# Altium schematic sheet ACEstat_carrier.SchDoc: ACEstat Carrier Board
size 419 x 296 mm; Date: 2/1/2022; Author: Eric Brown; DrawnBy: Eric Brown; Engineer: Eric Brown; Revision: 1.0.0; SheetNumber: 1; SheetTotal: 1; ProjectTitle: Mobile Environmental Contaminant Sensors Program; BranchName: Sensors Integration branch
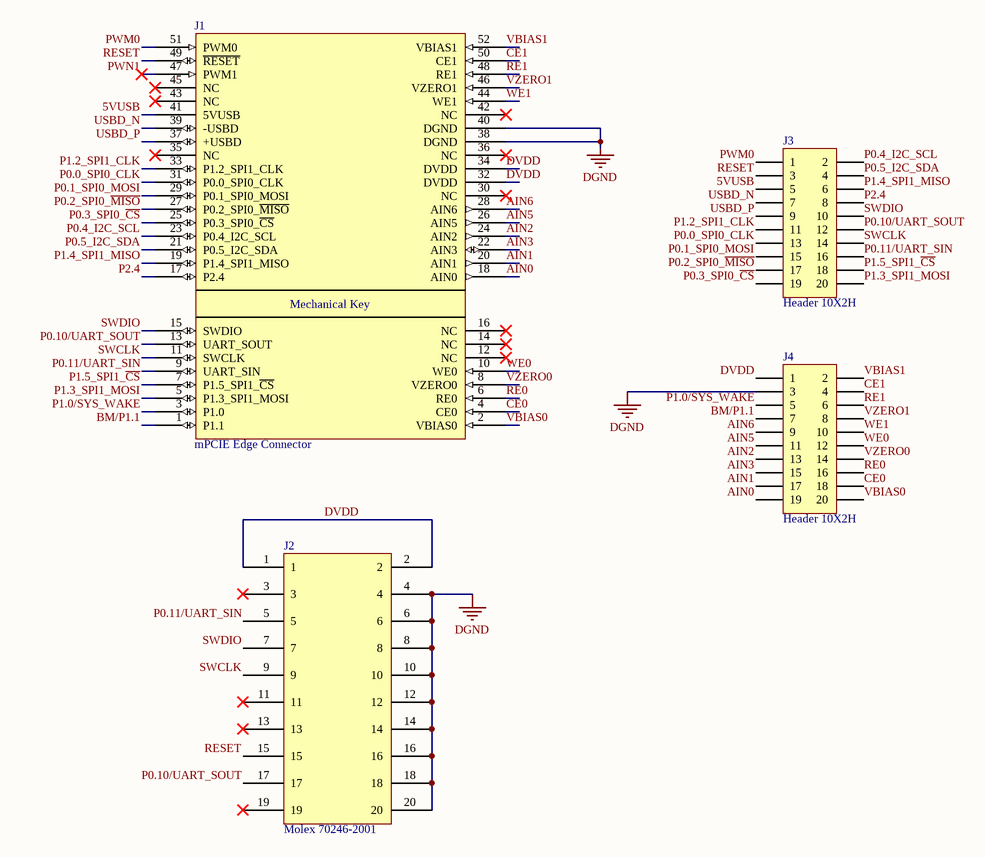
[diagram p0: ACEstat_carrier.SchDoc]

## Parts
J1  mPCIE Edge Connector  [MPCIE_BOARD_CONNECTOR]
J2  Molex 70246-2001  [Molex 70246-2001]
J3  Header 10X2H  [HDR2X10H]
J4  Header 10X2H  [HDR2X10H]

## Nets
DGND: J1.38(DGND) J1.40(DGND) J2.4 J2.6 J2.8 J2.10 J2.12 J2.14 J2.16 J2.18 J2.20 J4.3
5VUSB: J1.41(5VUSB) J3.5
AIN0: J1.18(AIN0) J4.19
AIN1: J1.20(AIN1) J4.17
AIN2: J1.24(AIN2) J4.13
AIN3: J1.22(AIN3) J4.15
AIN5: J1.26(AIN5) J4.11
AIN6: J1.28(AIN6) J4.9
BM/P1.1: J1.1(P1.1) J4.7
CE0: J1.4(CE0) J4.18
CE1: J1.50(CE1) J4.4
DVDD: J1.32(DVDD) J1.34(DVDD) J2.1 J2.2 J4.1
P0.0_SPI0_CLK: J1.31(P0.0_SPI0_CLK) J3.13
P0.1_SPI0_MOSI: J1.29(P0.1_SPI0_MOSI) J3.15
P0.2_SPI0_~{MISO}: J1.27(P0.2_SPI0_~{MISO}) J3.17
P0.3_SPI0_~{CS}: J1.25(P0.3_SPI0_~{CS}) J3.19
P0.4_I2C_SCL: J1.23(P0.4_I2C_SCL) J3.2
P0.5_I2C_SDA: J1.21(P0.5_I2C_SDA) J3.4
P0.10/UART_SOUT: J1.13(UART_SOUT) J2.17 J3.12
P0.11/UART_SIN: J1.9(UART_SIN) J2.5 J3.16
P1.0/SYS_WAKE: J1.3(P1.0) J4.5
P1.2_SPI1_CLK: J1.33(P1.2_SPI1_CLK) J3.11
P1.3_SPI1_MOSI: J1.5(P1.3_SPI1_MOSI) J3.20
P1.4_SPI1_MISO: J1.19(P1.4_SPI1_MISO) J3.6
P1.5_SPI1_~{CS}: J1.7(P1.5_SPI1_~{CS}) J3.18
P2.4: J1.17(P2.4) J3.8
PWM0: J1.51(PWM0) J3.1
PWN1: J1.47(PWM1)
RE0: J1.6(RE0) J4.16
RE1: J1.48(RE1) J4.6
RESET: J1.49(~{RESET}) J2.15 J3.3
SWCLK: J1.11(SWCLK) J2.9 J3.14
SWDIO: J1.15(SWDIO) J2.7 J3.10
USBD_N: J1.39(-USBD) J3.7
USBD_P: J1.37(+USBD) J3.9
VBIAS0: J1.2(VBIAS0) J4.20
VBIAS1: J1.52(VBIAS1) J4.2
VZERO0: J1.8(VZERO0) J4.14
VZERO1: J1.46(VZERO1) J4.8
WE0: J1.10(WE0) J4.12
WE1: J1.44(WE1) J4.10

Not connected (* = marked no-connect by the designer): J1 12(NC)* 14(NC)* 16(NC)* 30(NC)* 35(NC)* 36(NC)* 42(NC)* 43(NC)* 45(NC)*; J2 3* 11* 13* 19*

## Notes on the sheet
- Title
- Revision
- Project
- Approver
- Date
- Branch
- File
- (in symbol mPCIE_Edge) Mechanical Key

## Library data of the parts
J1 = mPCIE_Edge
J2 = Molex 70246-2001: 20-pin JTAG female connector
J3 J4 = Header 10X2H: Header, 10-Pin, Dual row, Right Angle; LatestRevisionDate: 17-Jul-2002; LatestRevisionNote: Re-released for DXP Platform.; Publisher: Altium Limited